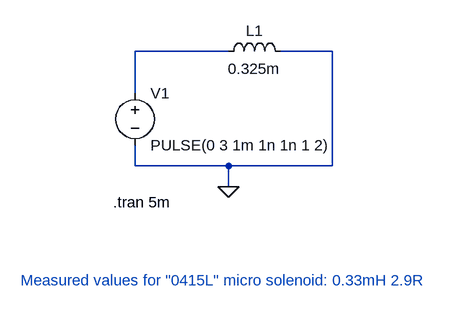
[diagram p0: schematic Basic_Solenoid_Inductance.asc]
Basic_Solenoid_Inductance.asc, the LTspice schematic file:
Version 4
SHEET 1 880 680
WIRE 64 144 -80 144
WIRE 224 144 144 144
WIRE -80 208 -80 144
WIRE -80 320 -80 288
WIRE 64 320 -80 320
WIRE 224 320 224 144
WIRE 224 320 64 320
WIRE 64 352 64 320
FLAG 64 352 0
SYMBOL ind 48 160 R270
WINDOW 0 32 56 VTop 2
WINDOW 3 5 56 VBottom 2
SYMATTR InstName L1
SYMATTR Value 0.325m
SYMATTR SpiceLine Rser=2.9
SYMBOL voltage -80 192 R0
WINDOW 123 0 0 Left 0
WINDOW 39 0 0 Left 0
SYMATTR InstName V1
SYMATTR Value PULSE(0 3 1m 1n 1n 1 2)
TEXT -114 376 Left 2 !.tran 5m
TEXT -256 496 Left 2 ;Measured values for "0415L" micro solenoid: 0.33mH 2.9R

The netlist it stands for:
* Basic_Solenoid_Inductance.asc
L1 N001 0 0.325m Rser=2.9
V1 N001 0 PULSE(0 3 1m 1n 1n 1 2)
.tran 5m
* Measured values for "0415L" micro solenoid: 0.33mH 2.9R
.backanno
.end